# EAGLE design D1MSHO (EAGLE 8.2.2)
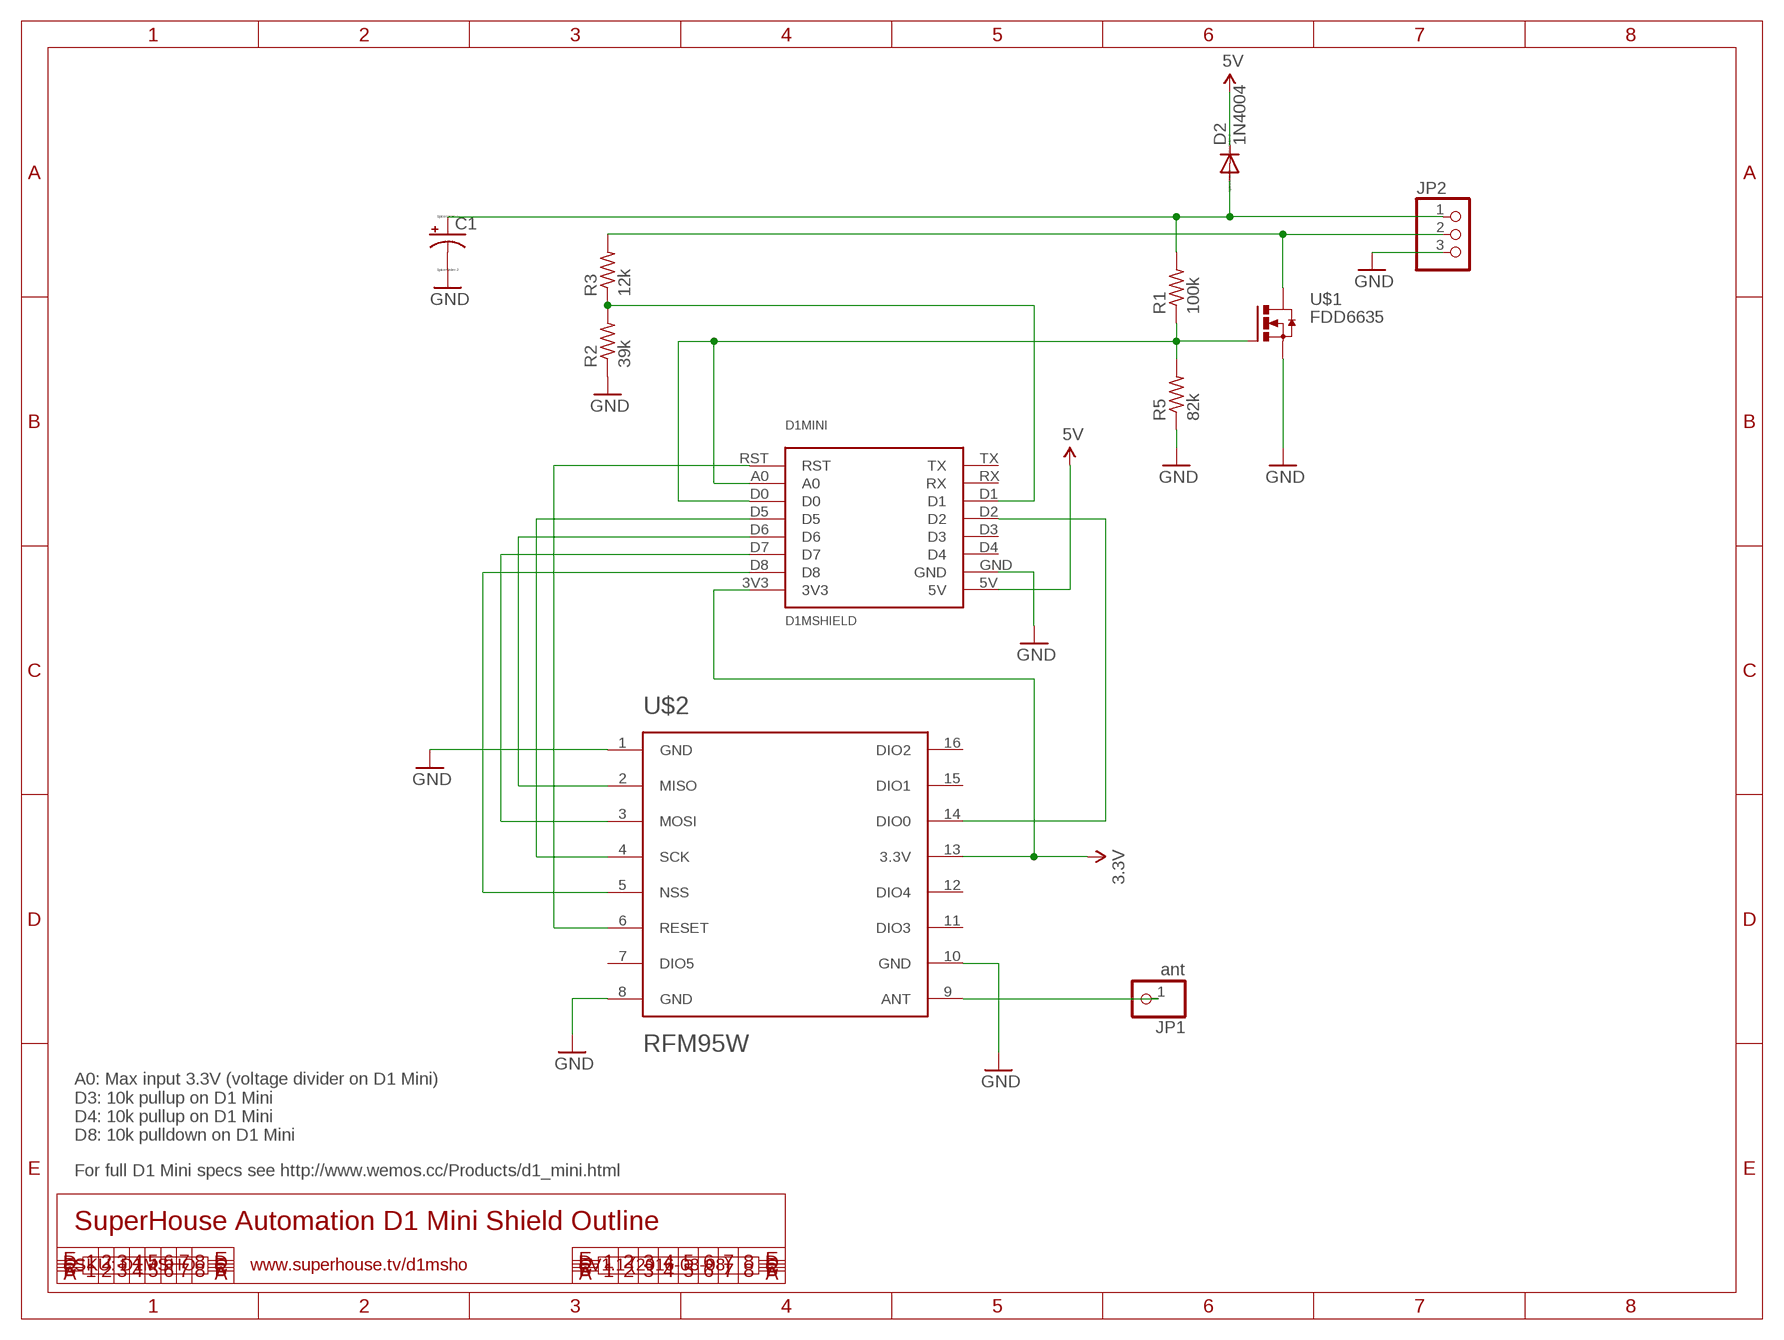
[diagram p0: schematic, sheet 1]

## Parts
C1  CPOL-USE3.5-8  [E3,5-8]
D1MINI  D1MSHIELD  [D1MSHELD]
D2  1N4004  [DO41-10]
JP1  ant  PINHD-1X1  [1X01]
JP2  PINHD-1X3/90  [1X03/90]
R1  100k  R-US_M0805  [M0805]
R2  39k  R-US_M0805  [M0805]
R3  12k  R-US_M0805  [M0805]
R5  82k  R-US_M0805  [M0805]
U$1  FDD6635  [TO252]
U$2  RFM95W  [RFM]

## Nets
3.3V: D1MINI.3V3 U$2.13(3.3V)
5V: D1MINI.5V D2.C
A0: D1MINI.A0 D1MINI.D0 R1.1 R5.2 U$1.1(G)
ANT: JP1.1 U$2.9(ANT)
D5: D1MINI.D5 U$2.4(SCK)
D6: D1MINI.D6 U$2.2(MISO)
D7: D1MINI.D7 U$2.3(MOSI)
D8: D1MINI.D8 U$2.5(NSS)
GND: C1.- D1MINI.GND JP2.3 R2.1 R5.1 U$1.2(S) U$2.1(GND) U$2.8(GND) U$2.10(GND)
N$1: JP2.2 R3.2 U$1.3(D)
N$2: D1MINI.D1 R2.2 R3.1
N$3: C1.+ D2.A JP2.1 R1.2
N$6: D1MINI.D2 U$2.14(DIO0)
RST: D1MINI.RST U$2.6(RESET)
Unconnected: D1MINI.D3 D1MINI.D4 D1MINI.RX D1MINI.TX U$2.7(DIO5) U$2.11(DIO3) U$2.12(DIO4) U$2.15(DIO1) U$2.16(DIO2)

## Notes on the sheet
- A0: Max input 3.3V (voltage divider on D1 Mini)
  D3: 10k pullup on D1 Mini
  D4: 10k pullup on D1 Mini
  D8: 10k pulldown on D1 Mini
- For full D1 Mini specs see http://www.wemos.cc/Products/d1_mini.html
- SuperHouse Automation D1 Mini Shield Outline
- SKU: D1MSHO | www.superhouse.tv/d1msho | V1.1 (2016-03-08)

## Library data of the parts
C1 = resistor:CPOL-US: POLARIZED CAPACITOR, American symbol
D1MINI = d1mshield:D1MSHIELD: d1 mini shield
D2 = diode:1N4004: DIODE general purpose rectifier, 1 A
JP1 = pinhead:PINHD-1X1: PIN HEADER
JP2 = pinhead:PINHD-1X3: PIN HEADER
R1-R3 R5 = resistor:R-US_: RESISTOR, American symbol
U$1 = fdd6635:FDD6635
U$2 = hoperf_radios:RFM95W

## Net classes
0 default: width 0.203 mm, drill 0.356 mm, clearance 0.152 mm
1 power: width 0.203 mm, clearance 0.152 mm

## Board
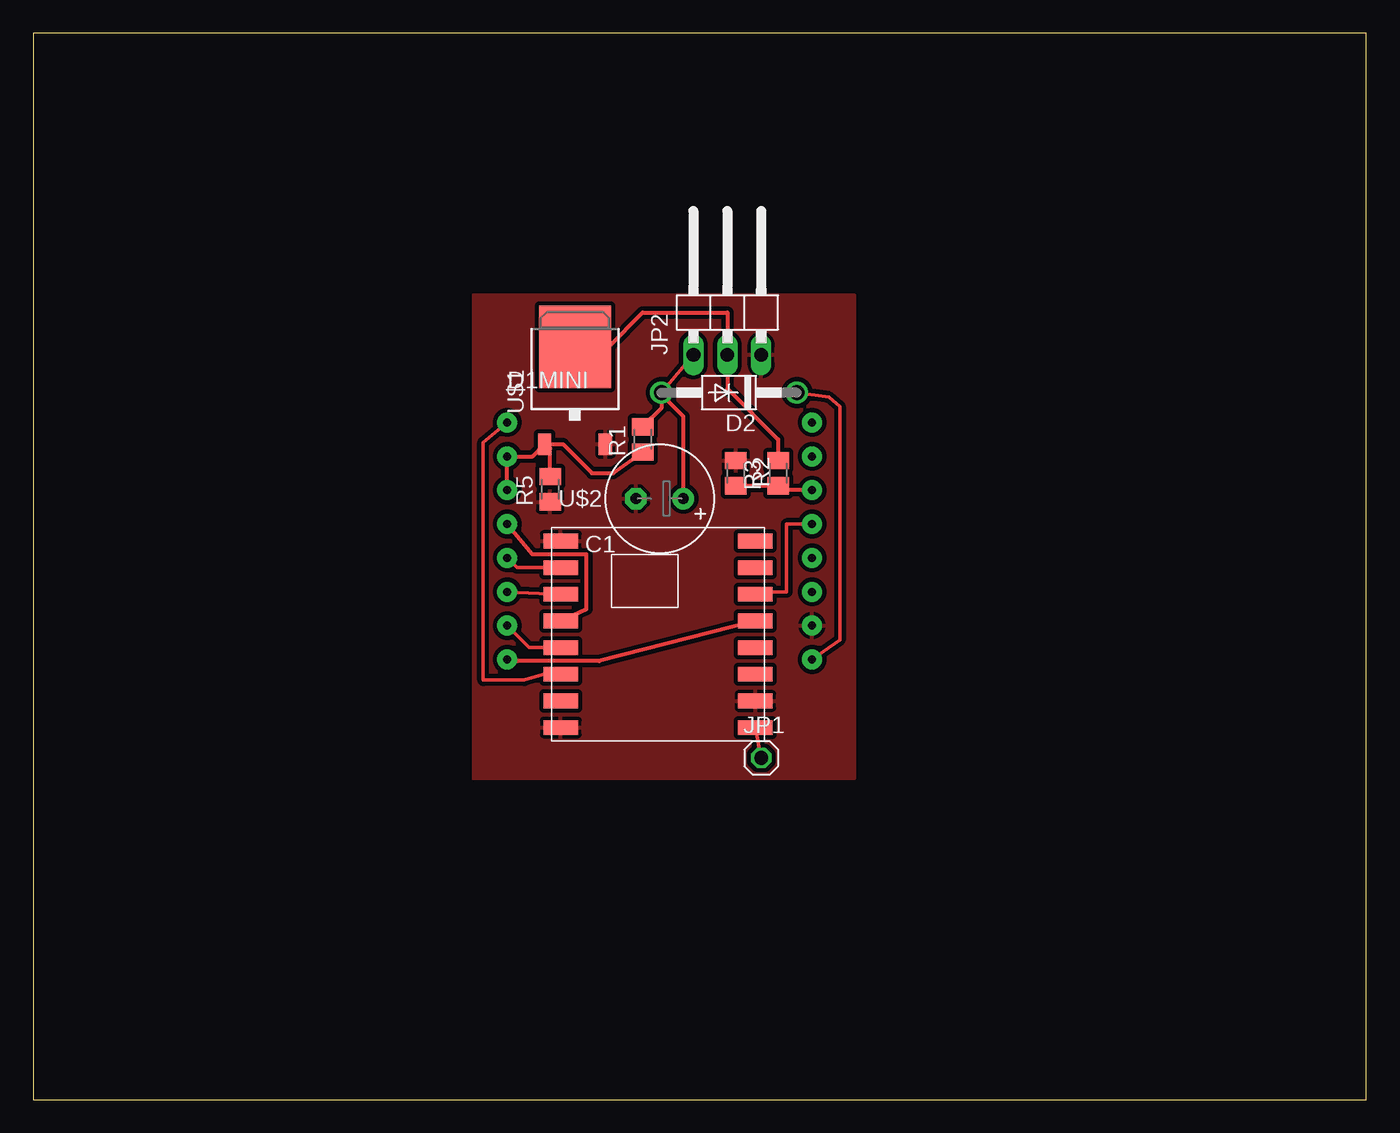
[diagram p1: board, top side]

Size 100 x 80 mm. Coordinates in mm from the lower left corner, seen from the top.
Outline: 0,0 100,0 100,80 0,80 0,0
Copper layers (1*16): Top 0.035mm / dielectric 1.5mm / Bottom 0.035mm
Design rules "default": minimum track width 10mil, minimum drill 24mil, track to track 8mil, track to pad 8mil, pad to pad 8mil, via to via 8mil, smd to smd 8mil, copper to edge 40mil, drill to drill 8mil, minimum pad ring 10mil, minimum via ring 8mil, stop-mask expansion 4mil, vias tented up to drill 0mil, thermal gap 10mil

### Footprints (pad centres in the part's own frame; a part is rotated, then mirrored left to right if it is on the bottom)
E3,5-8 = drill 0.813 pad 1.6: + -1.778,0 | drill 0.813 pad 1.6 octagon: - 1.778,0
D1MSHELD = drill 0.6 pad 1.5: 3V3 0,-17.78; 5V 22.86,-17.78; A0 0,-2.54; D0 0,-5.08; D1 22.86,-5.08; D2 22.86,-7.62; D3 22.86,-10.16; D4 22.86,-12.7; D5 0,-7.62; D6 0,-10.16; D7 0,-12.7; D8 0,-15.24; GND 22.86,-15.24; RST 0,0; RX 22.86,-2.54; TX 22.86,0
DO41-10 = drill 1.118: A 5.08,0; C -5.08,0
1X01 = drill 1.016 octagon: 1 0,0
1X03/90 = drill 1.016 long: 1 -2.54,-3.81; 2 0,-3.81; 3 2.54,-3.81
M0805 = smd 1.3 x 1.6: 1 -0.95,0; 2 0.95,0
TO252 = smd 1 x 1.6: 1 -2.28,-4.8; 2 2.28,-4.8 | smd 5.4 x 6.2: 3 0,2.5
RFM = smd 2.6 x 1.1: 1 0.2,0; 2 0.2,-2; 3 0.2,-4; 4 0.2,-6; 5 0.2,-8; 6 0.2,-10; 7 0.2,-12; 8 0.2,-14; 9 14.8,-14; 10 14.8,-12; 11 14.8,-10; 12 14.8,-8; 13 14.8,-6; 14 14.8,-4; 15 14.8,-2; 16 14.8,0

### Placement (x,y rotation side)
C1  46.99,45.09 180 top
D1MINI  35.56,50.8 0 top
D2  52.2,53.04 180 top
JP1  54.61,25.63 0 top
JP2  52.07,59.69 0 top
R1  45.72,49.53 90 top
R2  52.7,46.99 270 top
R3  55.88,46.99 90 top
R5  38.77,45.8 90 top
U$1  40.64,53.98 0 top
U$2  39.37,41.91 0 top

### Tracks (layer width: path | path; a pad name or v marks a point on that pad's centre or on a via)
3.3V
  Top 0.305: U$2.13 42.45,32.9 36.3,32.9 D1MINI.3V3
5V
  Top 0.254: D2.C 59.69,52.7 60.5,52 60.5,34.5 D1MINI.5V
A0
  Top 0.305: 35.95,46.12 D1MINI.D0 D1MINI.A0 37.45,48.26 U$1.1 38.47,49.17 | 38.47,49.17 39.73,49.17 41.91,46.99 43.49,46.99 R1.1 | R5.2 38.77,48.87 38.47,49.17
ANT
  Top 0.254: JP1.1 U$2.9
D5
  Top 0.305: U$2.4 41.5,36.8 41.5,40.9 37.45,40.9 D1MINI.D5
D6
  Top 0.254: D1MINI.D6 36.29,39.91 U$2.2
D7
  Top 0.254: U$2.3 D1MINI.D7
D8
  Top 0.254: U$2.5 37.21,33.91 D1MINI.D8
GND
  pour Top (isolate 0.32): 33.02,60.33 33.02,24.13 61.59,24.13 61.59,60.33
N$1
  Top 0.305: U$1.3 43.14,56.48 45.72,59.05 52.07,59.05 JP2.2 52.07,53.34 55.88,49.53 R3.2
N$2
  Top 0.305: R2.2 R3.1 56.2,45.72 D1MINI.D1
N$3
  Top 0.254: JP2.1 47.13,53.06 D2.A
  Top 0.305: 45.09,51.01 R1.2 47.12,51.88 D2.A | 47.13,53.06 47.05,52.97 48.77,51.24 C1.+
N$6
  Top 0.254: D1MINI.D2 56.52,43.18 56.52,38.1 54.17,38.1 U$2.14
RST
  Top 0.254: U$2.6 38.26,31.91 36.83,31.48 33.75,31.48 33.75,49.3 D1MINI.RST